# Altium schematic sheet osc.SchDoc
size A4; SheetNumber: 4; SheetTotal: 5
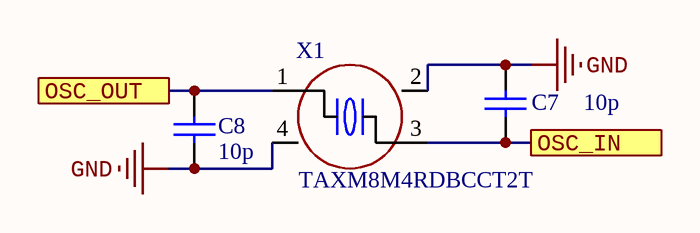
[diagram p0: osc.SchDoc]

## Parts
C7  value 10p  [CAPC100X50X55L25N]  (hidden comment: Capacitor)
C8  value 10p  [CAPC100X50X55L25N]  (hidden comment: Capacitor)
X1  TAXM8M4RDBCCT2T  [OSCCC320X250X80L90X100N]

## Ports
OSC_IN, OSC_OUT

## Nets
GND: C7.2 C8.1 X1.2(GND) X1.4(GND)
OSC_IN: C7.1 X1.3 ; port OSC_IN
OSC_OUT: C8.2 X1.1 ; port OSC_OUT

## Library data of the parts
C7 C8 = GRM188R61E106KA73D: MPN: CC0402JRNPO9BN100; Manufacturer: YAGEO(国巨); 编号: C106199; Case/Package: 0402; Mounting Type: SMD
X1 = X32258MSB4SI: 8MHz ±10ppm 10pF; Manufacturer: TAE(雅晶鑫); 编号: C400090